# Altium schematic sheet Temperature.SchDoc
size 420 x 297 mm; SheetNumber: 3; SheetTotal: 10; PageSetup: Record=PageOptions|CenterHorizontal=True|CenterVertical=True|PrintScale=0.96|XCorrection=1.00|YCorrection=1.00|PrintKind=1|BorderSize=5000000|LeftOffset=0|BottomOffset=0|Orientation=2|PaperLength=4318|PaperWidth=2794|Scale=100|PaperSource=7|PrintQuality=600|MediaType=1|DitherType=10|PaperKind=11" x 17"|PrintScaleMode=1
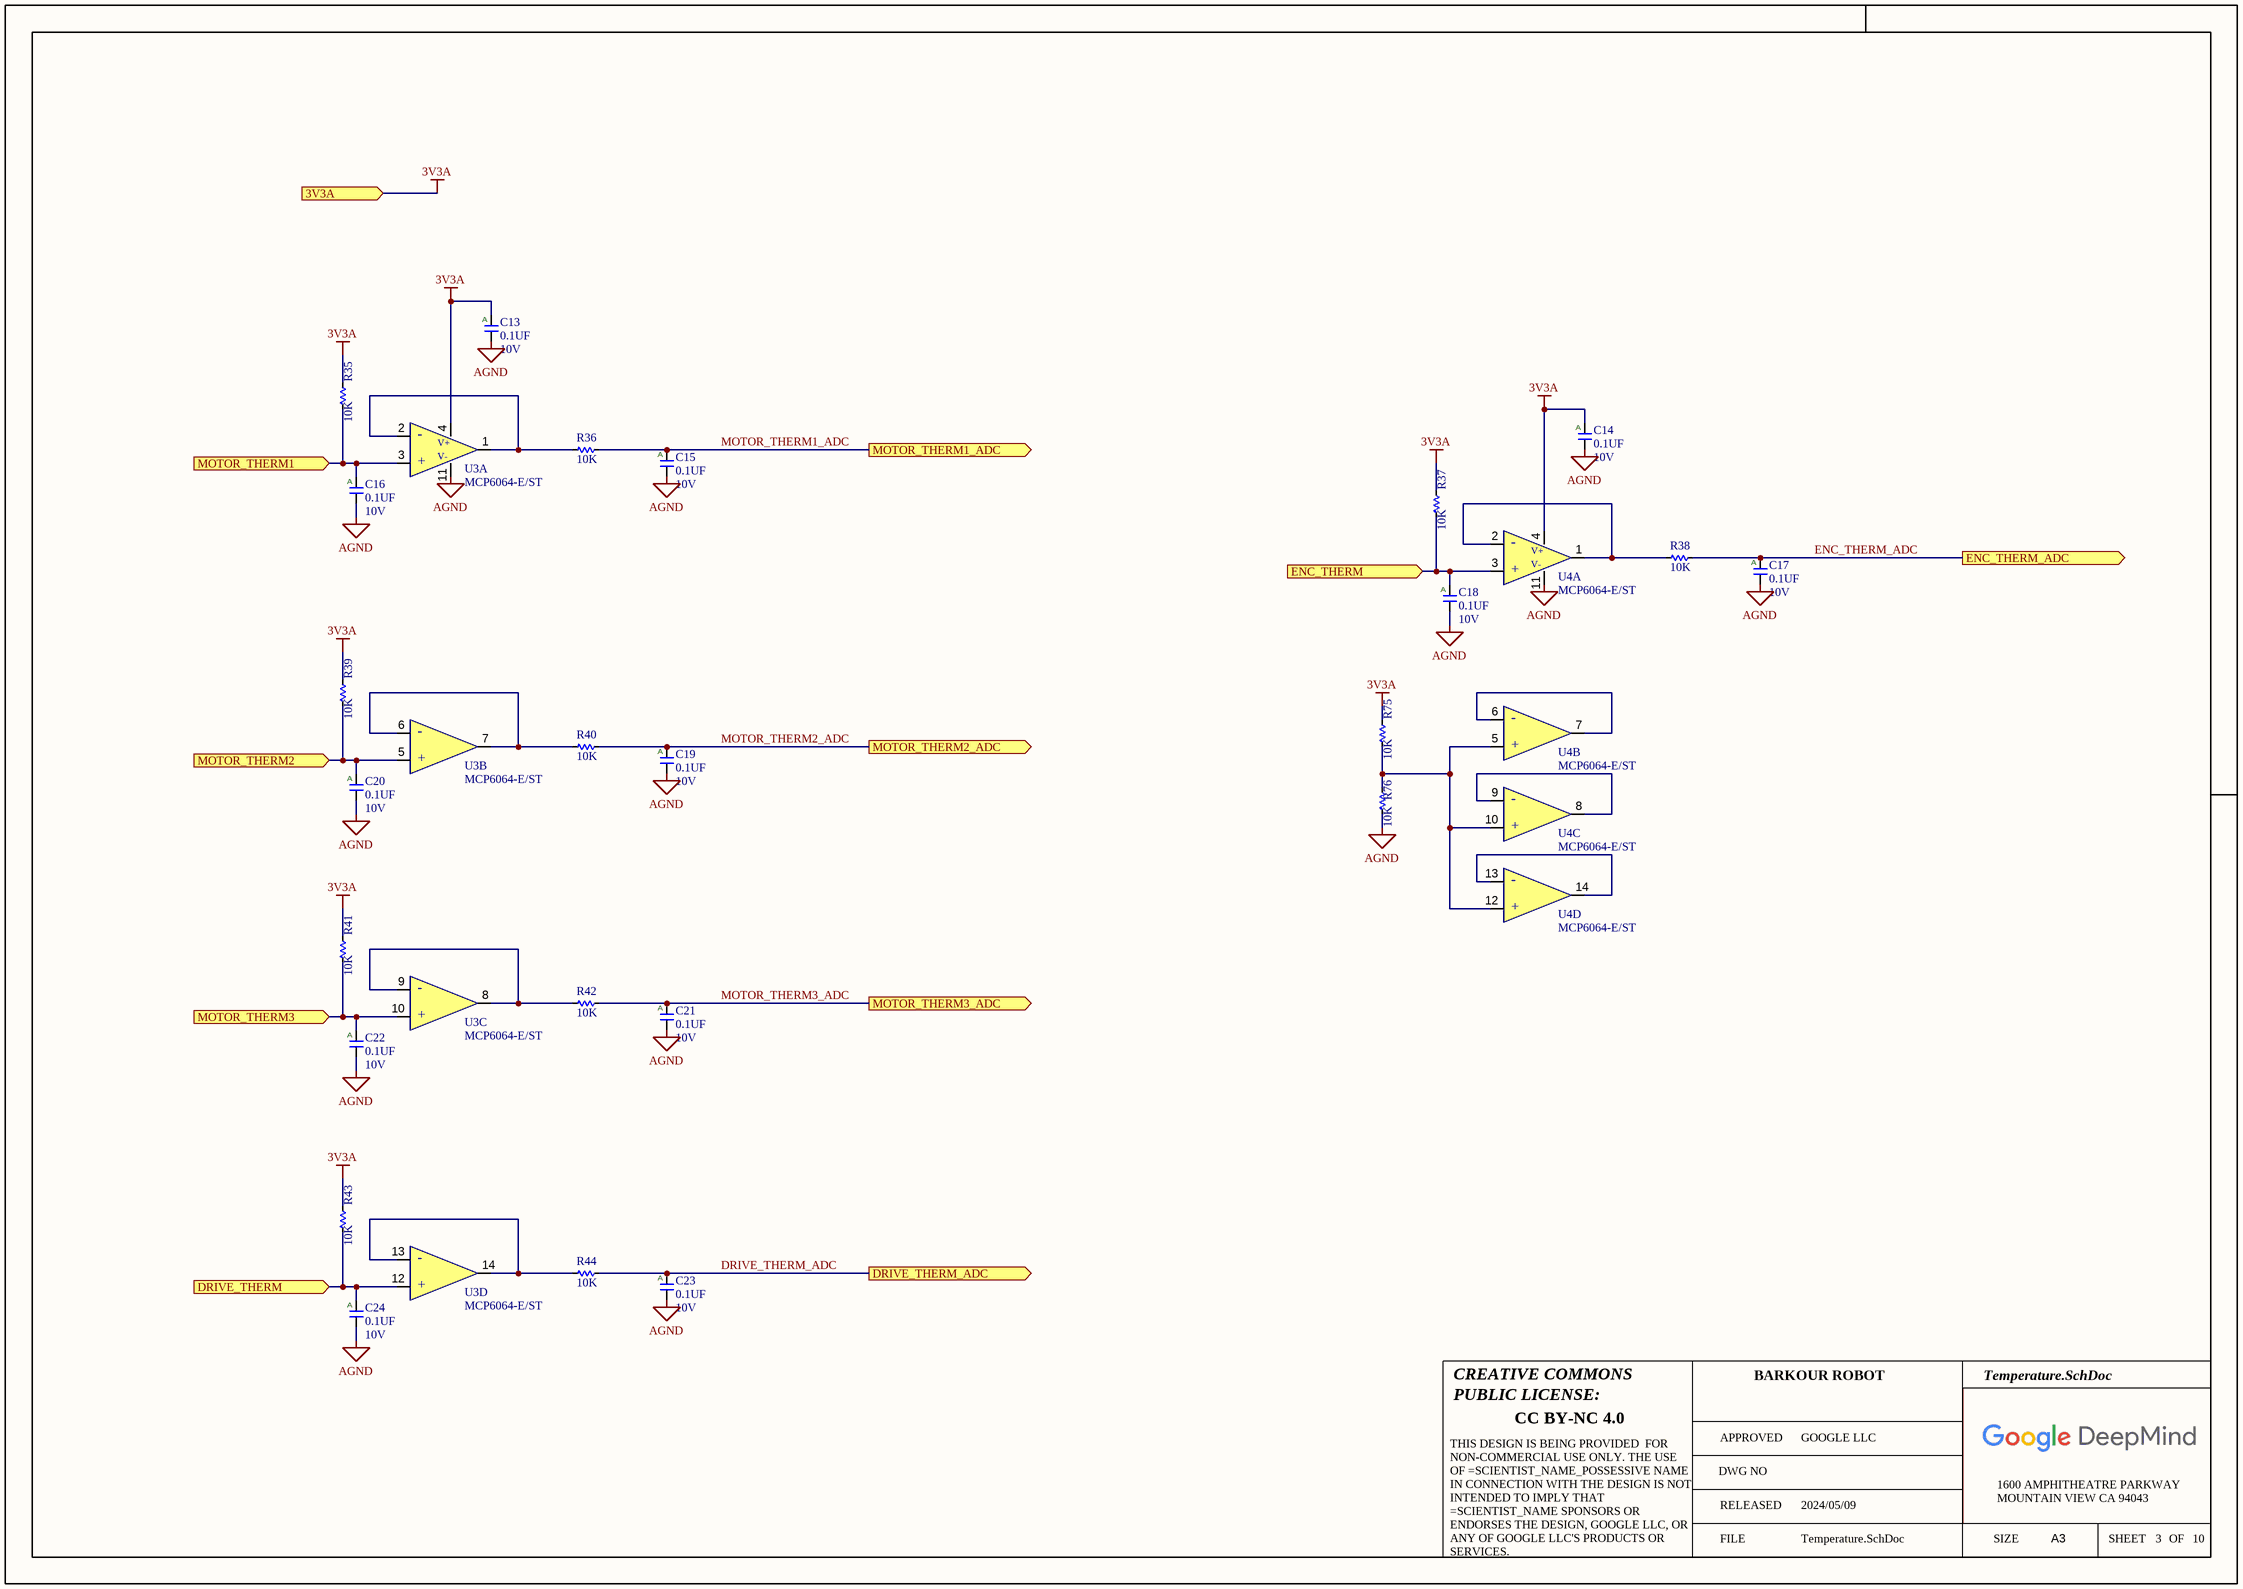
[diagram p0: Temperature.SchDoc]

## Parts
C13  value 0.1UF  Voltage: 10V  [C0201Y]  (hidden comment: __Template_Cap_Auto)
C14  value 0.1UF  Voltage: 10V  [C0201Y]  (hidden comment: __Template_Cap_Auto)
C15  value 0.1UF  Voltage: 10V  [C0201Y]  (hidden comment: __Template_Cap_Auto)
C16  value 0.1UF  Voltage: 10V  [C0201Y]  (hidden comment: __Template_Cap_Auto)
C17  value 0.1UF  Voltage: 10V  [C0201Y]  (hidden comment: __Template_Cap_Auto)
C18  value 0.1UF  Voltage: 10V  [C0201Y]  (hidden comment: __Template_Cap_Auto)
C19  value 0.1UF  Voltage: 10V  [C0201Y]  (hidden comment: __Template_Cap_Auto)
C20  value 0.1UF  Voltage: 10V  [C0201Y]  (hidden comment: __Template_Cap_Auto)
C21  value 0.1UF  Voltage: 10V  [C0201Y]  (hidden comment: __Template_Cap_Auto)
C22  value 0.1UF  Voltage: 10V  [C0201Y]  (hidden comment: __Template_Cap_Auto)
C23  value 0.1UF  Voltage: 10V  [C0201Y]  (hidden comment: __Template_Cap_Auto)
C24  value 0.1UF  Voltage: 10V  [C0201Y]  (hidden comment: __Template_Cap_Auto)
R35  value 10K  [R0201_H0.26MM]  (hidden comment: __Template_Resistor)
R36  value 10K  [R0201_H0.26MM]  (hidden comment: __Template_Resistor)
R37  value 10K  [R0201_H0.26MM]  (hidden comment: __Template_Resistor)
R38  value 10K  [R0201_H0.26MM]  (hidden comment: __Template_Resistor)
R39  value 10K  [R0201_H0.26MM]  (hidden comment: __Template_Resistor)
R40  value 10K  [R0201_H0.26MM]  (hidden comment: __Template_Resistor)
R41  value 10K  [R0201_H0.26MM]  (hidden comment: __Template_Resistor)
R42  value 10K  [R0201_H0.26MM]  (hidden comment: __Template_Resistor)
R43  value 10K  [R0201_H0.26MM]  (hidden comment: __Template_Resistor)
R44  value 10K  [R0201_H0.26MM]  (hidden comment: __Template_Resistor)
R75  value 10K  [R0201_H0.26MM]  (hidden comment: __Template_Resistor)
R76  value 10K  [R0201_H0.26MM]  (hidden comment: __Template_Resistor)
U3  Manufacturer Part Number: MCP6064-E/ST  [14TSSOP65]  (hidden comment: MCP6064)  (parts A,B,C,D of 4)
U4  Manufacturer Part Number: MCP6064-E/ST  [14TSSOP65]  (hidden comment: MCP6064)  (parts A,B,C,D of 4)

## Ports
3V3A (in), DRIVE_THERM (in), DRIVE_THERM_ADC (out), ENC_THERM (in), ENC_THERM_ADC (out), MOTOR_THERM1 (in), MOTOR_THERM1_ADC (out), MOTOR_THERM2 (in), MOTOR_THERM2_ADC (out), MOTOR_THERM3 (in), MOTOR_THERM3_ADC (out)

## Nets
3V3A: C13.1 C14.1 R35.2 R37.2 R39.2 R41.2 R43.2 R75.2 U3.4 U4.4 ; port 3V3A
AGND: C13.2 C14.2 C15.2 C16.2 C17.2 C18.2 C19.2 C20.2 C21.2 C22.2 C23.2 C24.2 R76.1 U3.11 U4.11
DRIVE_THERM: C24.1 R43.1 U3.12 ; port DRIVE_THERM
DRIVE_THERM_ADC: C23.1 R44.2 ; port DRIVE_THERM_ADC
ENC_THERM: C18.1 R37.1 U4.3 ; port ENC_THERM
ENC_THERM_ADC: C17.1 R38.2 ; port ENC_THERM_ADC
MOTOR_THERM1: C16.1 R35.1 U3.3 ; port MOTOR_THERM1
MOTOR_THERM1_ADC: C15.1 R36.2 ; port MOTOR_THERM1_ADC
MOTOR_THERM2: C20.1 R39.1 U3.5 ; port MOTOR_THERM2
MOTOR_THERM2_ADC: C19.1 R40.2 ; port MOTOR_THERM2_ADC
MOTOR_THERM3: C22.1 R41.1 U3.10 ; port MOTOR_THERM3
MOTOR_THERM3_ADC: C21.1 R42.2 ; port MOTOR_THERM3_ADC
NetR36_1: R36.1 U3.1 U3.2
NetR38_1: R38.1 U4.1 U4.2
NetR40_1: R40.1 U3.6 U3.7
NetR42_1: R42.1 U3.8 U3.9
NetR44_1: R44.1 U3.13 U3.14
NetR75_1: R75.1 R76.2 U4.5 U4.10 U4.12
NetU4_6: U4.6 U4.7
NetU4_8: U4.8 U4.9
NetU4_13: U4.13 U4.14

## Notes on the sheet
- CREATIVE COMMONS
- PUBLIC LICENSE:
- BARKOUR ROBOT
- CC BY-NC 4.0
- APPROVED
- DWG NO
- GOOGLE LLC
- FILE
- RELEASED
- 2024/05/09
- SIZE
- 1600 AMPHITHEATRE PARKWAY
- MOUNTAIN VIEW CA 94043
- A3
- SHEET
- OF
- THIS DESIGN IS BEING PROVIDED  FOR NON-COMMERCIAL USE ONLY. THE USE OF =SCIENTIST_NAME_POSSESSIVE NAME IN CONNECTION WITH THE DESIGN IS NOT INTENDED TO IMPLY THAT =SCIENTIST_NAME SPONSORS OR ENDORSES THE DESIGN, GOOGLE LLC, OR ANY OF GOOGLE LLC'S PRODUCTS OR SERVICES.
- (in symbol 934) A
- (in symbol MICROCHIP_MCP6064, part A) -; V+; V-; +
- (in symbol MICROCHIP_MCP6064, part B) -; +
- (in symbol MICROCHIP_MCP6064, part C) -; +
- (in symbol MICROCHIP_MCP6064, part D) -; +

## Library data of the parts
C13-C24 = 934: CAP, CER, X6S, 0.1uF, 10V, 10%, 0201, AUTOGRADE; ID: 934; MFG: MURATA; MFG P/N: GRT033C81A104KE01D; XPN: 150-01178-00; Gecko: 150-04546-00; EES: 150-04563-00; Status: Released; Package: 0201; Dielectric: X6S; Tolerance: 10%; Height: 0.33mm T; Supplier 1: Digi-key; HelpURL: https://www.digikey.com/product-detail/en/murata-electronics/GRT033C81A104KE01D/490-12232-1-ND/5416933; ComponentLink1Description: Datasheet; ComponentLink1URL: https://search.murata.co.jp/Ceramy/image/img/A01X/G101/ENG/GRT033C81A104KE01-01.pdf; COMMON: 150-01178-00; LOON: 150-01178-00; Supplier Part Number 1: 490-12232-1-ND
R35-R44 R75 R76 = 6783: RES, 10K, 1%, 1/20W, 0201, AUTOGRADE; ID: 6783; MFG: PANASONIC; MFG P/N: ERJ1GNF1002C; COMMON: 470-00033-00; PROXY: Use ID #4151; EES: 470-18014-00; Status: Released; Package: 0201; Power: 1/20W; Tolerance: 1%; Height: 0.26mm; Supplier 1: Digi-Key; HelpURL: https://www.digikey.in/product-detail/en/panasonic-electronic-components/ERJ-1GNF1002C/P122414CT-ND/7389440; ComponentLink1Description: Datasheet; ComponentLink1URL: https://industrial.panasonic.com/cdbs/www-data/pdf/RDA0000/AOA0000C304.pdf; LOON: 470-00033-00; Gecko: 470-00033-00; XPN: 470-00033-00; Supplier Part Number 1: P122414CT-ND
U3 U4 = MICROCHIP_MCP6064: Microchip MCP6064-E/ST; Quad Op Amp; 0.73MHz CMOS; Rail to Rail; 3V; 5V; 14-Pin TSSOP; Min Supply Voltage: 1.8V; Max Supply Voltage: 6V; Voltage Gain: 115dB; Common Mode Rejection Ratio: 72dB; Gain Bandwidth Product: 730kHz; Number of Channels: 4; Output Current: 27mA; Slew Rate: 0.25V/µs; Nominal Supply Current: 60uA; Input Bias Current: 100pA; Input Offset Voltage (Vos): 150uV; Power Supply Rejection Ratio (PSRR): 70dB; Amplifier Type: GENERAL PURPOSE; ComponentLink1URL: http://www.microchip.com/mymicrochip/filehandler.aspx?ddocname=en528763; ComponentLink1Description: http://www.microchip.com/mymicrochip/filehandler.aspx?ddocname=en528763; Supplier 1: Digi-Key; Supplier Part Number 1: MCP6064-E/ST-ND; Manufacturer: Microchip; RoHS: Yes; Category: Amplifiers - Op Amps, Buffer, Instrumentation; Stock 1: 117; Pricing 1: 1=1.83000, 25=1.52640, 100=1.42500 (USD); Mount: Surface Mount; Case/Package: TSSOP; Number of Pins: 14; Min Operating Temperature: -40°C; Max Operating Temperature: 125°C; Package Quantity: 96; Packaging: Rail/Tube; Bandwidth: 730kHz; Unity Gain Bandwidth Product: 730kHz; Number of Circuits: 4; Operating Supply Current: 60uA; Output Current per Channel: 27mA; Number of Elements: 4; Number of Amplifiers: 4; Supply Current: 60uA; Technology: CMOS; Input Offset Voltage-Max: 150uV; Slew Rate-Nom: 0.25V/µs; Length: 5mm; Width: 4.4mm; Height: 1mm; Radiation Hardening: No; REACH SVHC: No SVHC; Lead Free: Lead Free; RoHS Compliant: Yes; ComponentLink2URL: https://datasheet.ciiva.com/8078/mcp6061-ds22189b-8078832.pdf?src-supplier=Element14; ComponentLink2Description: https://datasheet.ciiva.com/8078/mcp6061-ds22189b-8078832.pdf?src-supplier=Element14; ComponentLink3URL: https://datasheet.ciiva.com/1802/mcp6061-ds22189b-1802877.pdf?src-supplier=Digi-Key; ComponentLink3Description: https://datasheet.ciiva.com/1802/mcp6061-ds22189b-1802877.pdf?src-supplier=Digi-Key; ComponentLink4URL: https://datasheet.ciiva.com/11707/jp542225-11707116.pdf?src-supplier=Avnet; ComponentLink4Description: https://datasheet.ciiva.com/11707/jp542225-11707116.pdf?src-supplier=Avnet; ComponentLink5URL: https://datasheet.ciiva.com/5777/1062687-5777669.pdf?src-supplier=Farnell; ComponentLink5Description: https://datasheet.ciiva.com/5777/1062687-5777669.pdf?src-supplier=Farnell; ComponentLink6URL: https://datasheet.ciiva.com/16348/filehandler-aspxddocname-en542225-16348939.pdf?src-supplier=Future+Electronics; ComponentLink6Description: https://datasheet.ciiva.com/16348/filehandler-aspxddocname-en542225-16348939.pdf?src-supplier=Future+Electronics